# EAGLE design abletondevicecontroller (EAGLE 8.3.2)
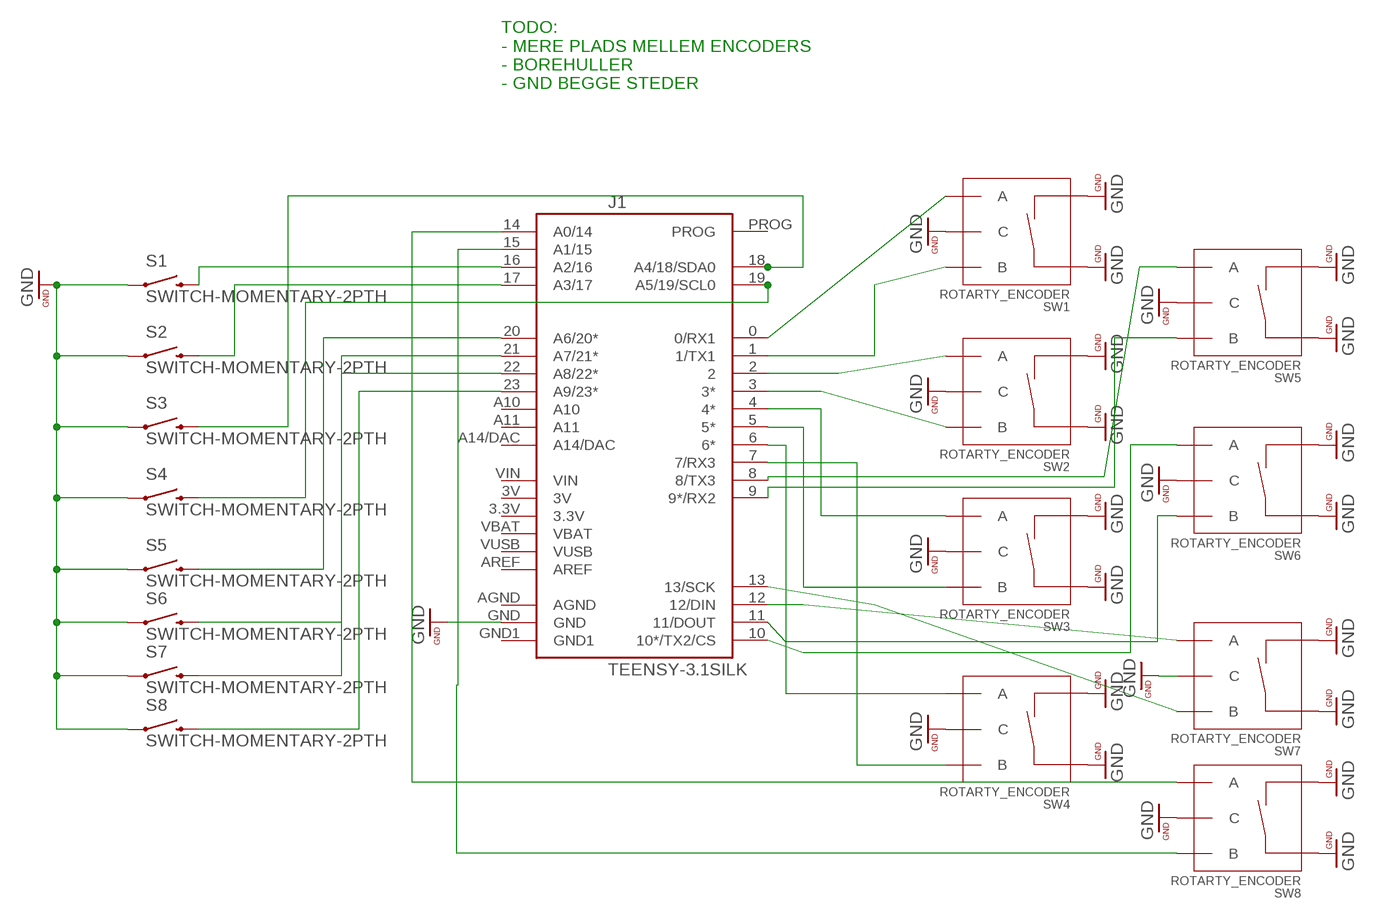
[diagram p0: schematic, sheet 1]

## Parts
J1  TEENSY-3.1SILK  [TEENSY-3.1]
S1  SWITCH-MOMENTARY-2PTH  [TACTILE-PTH]
S2  SWITCH-MOMENTARY-2PTH  [TACTILE-PTH]
S3  SWITCH-MOMENTARY-2PTH  [TACTILE-PTH]
S4  SWITCH-MOMENTARY-2PTH  [TACTILE-PTH]
S5  SWITCH-MOMENTARY-2PTH  [TACTILE-PTH]
S6  SWITCH-MOMENTARY-2PTH  [TACTILE-PTH]
S7  SWITCH-MOMENTARY-2PTH  [TACTILE-PTH]
S8  SWITCH-MOMENTARY-2PTH  [TACTILE-PTH]
SW1  ROTARTY_ENCODER  [ROTARY_ENC_PLAIN]
SW2  ROTARTY_ENCODER  [ROTARY_ENC_PLAIN]
SW3  ROTARTY_ENCODER  [ROTARY_ENC_PLAIN]
SW4  ROTARTY_ENCODER  [ROTARY_ENC_PLAIN]
SW5  ROTARTY_ENCODER  [ROTARY_ENC_PLAIN]
SW6  ROTARTY_ENCODER  [ROTARY_ENC_PLAIN]
SW7  ROTARTY_ENCODER  [ROTARY_ENC_PLAIN]
SW8  ROTARTY_ENCODER  [ROTARY_ENC_PLAIN]

## Nets
GND: J1.GND S1.1 S2.1 S3.1 S4.1 S5.1 S6.1 S7.1 S8.1 SW1.C SW1.SW+ SW1.SW- SW2.C SW2.SW+ SW2.SW- SW3.C SW3.SW+ SW3.SW- SW4.C SW4.SW+ SW4.SW- SW5.C SW5.SW+ SW5.SW- SW6.C SW6.SW+ SW6.SW- SW7.C SW7.SW+ SW7.SW- SW8.C SW8.SW+ SW8.SW-
N$1: J1.8(8/TX3) SW5.A
N$2: J1.9(9*/RX2) SW5.B
N$3: J1.10(10*/TX2/CS) SW6.A
N$4: J1.0(0/RX1) SW1.A
N$5: J1.1(1/TX1) SW1.B
N$6: J1.2 SW2.A
N$7: J1.3(3*) SW2.B
N$8: J1.4(4*) SW3.A
N$9: J1.5(5*) SW3.B
N$10: J1.6(6*) SW4.A
N$11: J1.7(7/RX3) SW4.B
N$12: J1.11(11/DOUT) SW6.B
N$13: J1.12(12/DIN) SW7.A
N$14: J1.13(13/SCK) SW7.B
N$15: J1.14(A0/14) SW8.A
N$16: J1.15(A1/15) SW8.B
N$17: J1.16(A2/16) S1.3
N$18: J1.17(A3/17) S2.3
N$19: J1.20(A6/20*) S5.3
N$20: J1.19(A5/19/SCL0) S4.3
N$21: J1.21(A7/21*) S6.3
N$22: J1.22(A8/22*) S7.3
N$23: J1.23(A9/23*) S8.3
N$28: J1.18(A4/18/SDA0) S3.3
Unconnected: J1.3.3V J1.3V J1.A10 J1.A11 J1.A14/DAC J1.AGND J1.AREF J1.GND1 J1.PROG J1.VBAT J1.VIN J1.VUSB

## Notes on the sheet
- TODO: 
  - MERE PLADS MELLEM ENCODERS
  - BOREHULLER
  - GND BEGGE STEDER

## Library data of the parts
J1 = SparkFun-Boards:TEENSY-3.1; SF_ID: DEV-12646
S1-S8 = SparkFun-Electromechanical:SWITCH-MOMENTARY-2: Various NO switches- pushbuttons, reed, etc; PROD_ID: SWCH-08441
SW1-SW8 = SparkFun-Electromechanical:ROTARTY_ENCODER: Simple no LED rotary encoder Example: COM-09117

## Board
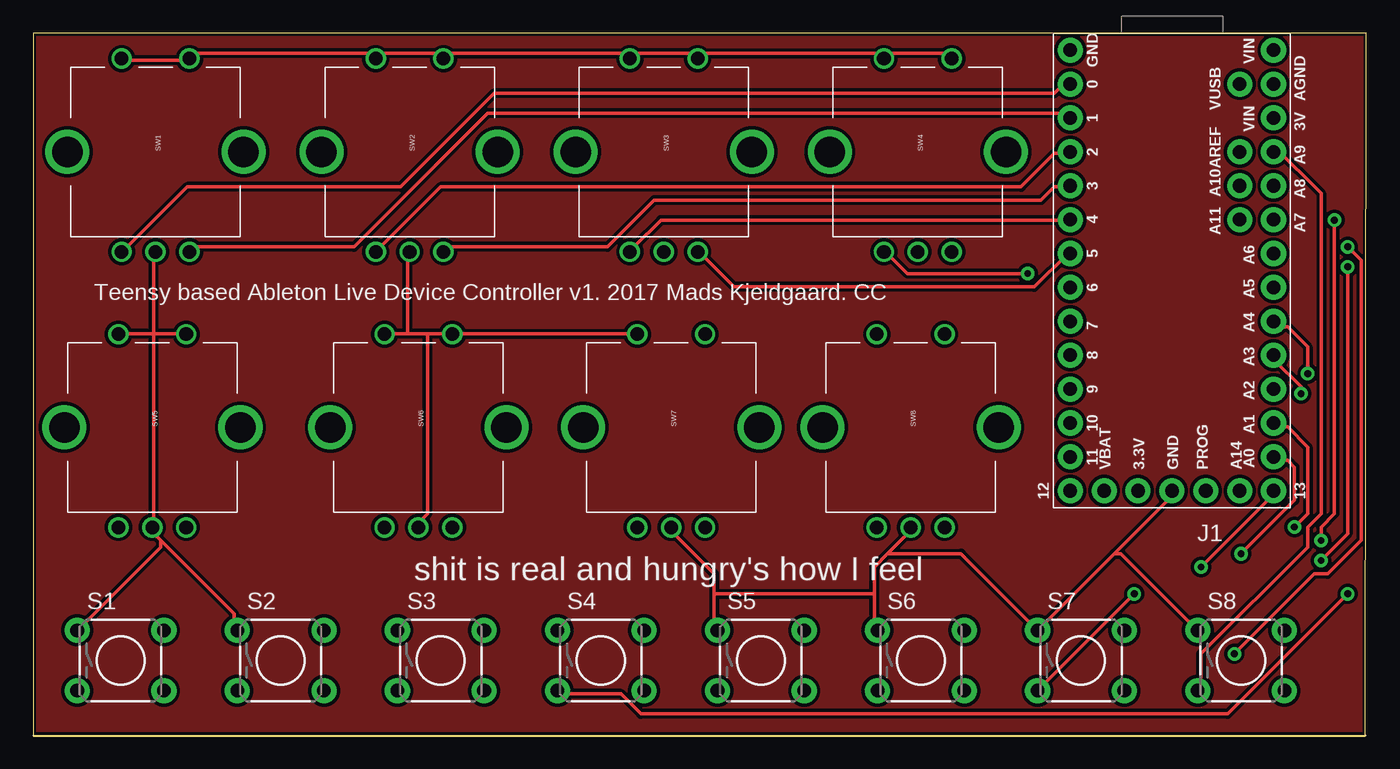
[diagram p1: board, top side]
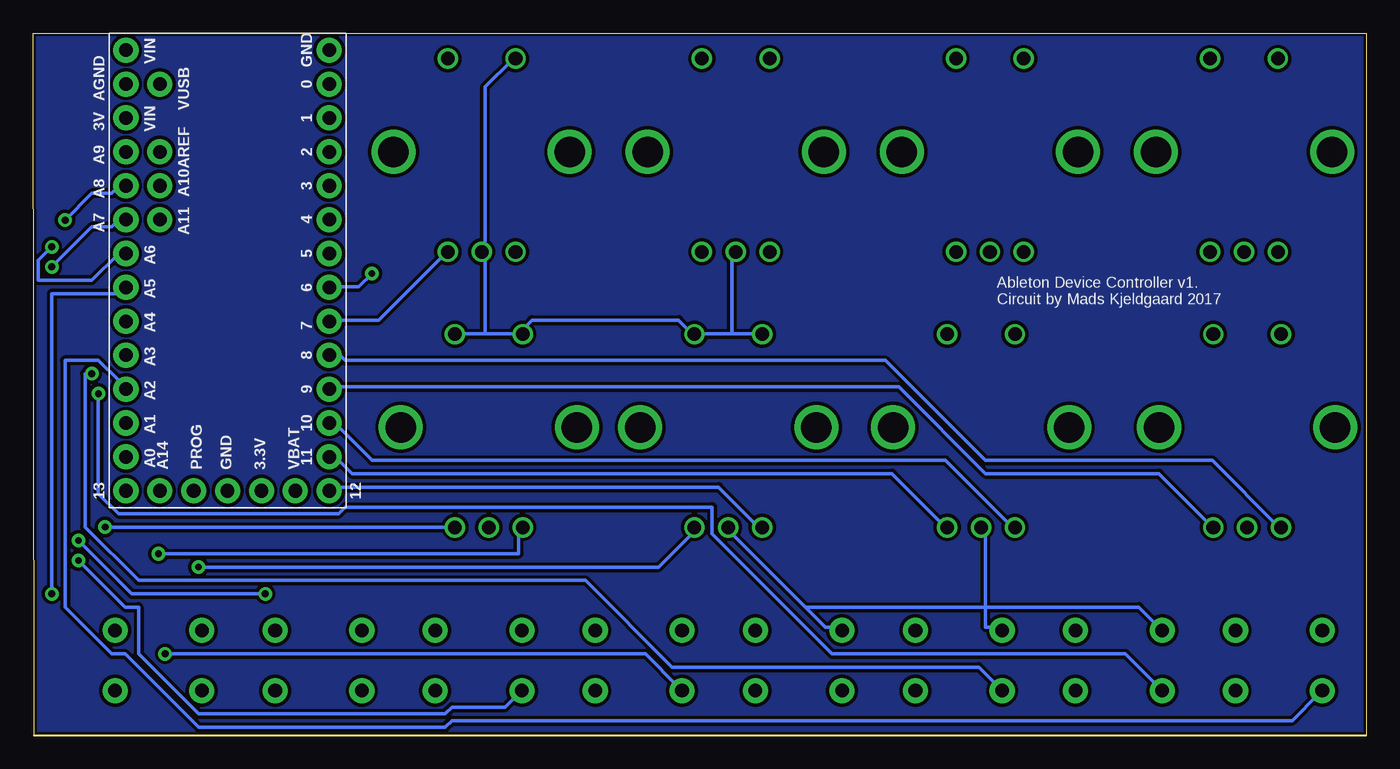
[diagram p2: board, bottom side, seen from below]

Size 99.92 x 52.63 mm. Coordinates in mm from the lower left corner, seen from the top.
Outline: 99.87,0 99.92,52.63 0,52.63 0,0 99.87,0
Copper layers (1*16): Top 0.035mm / dielectric 1.5mm / Bottom 0.035mm
Design rules "SparkFun-2-layer-STANDARD": minimum track width 10mil, minimum drill 20mil, track to track 10mil, track to pad 8mil, pad to pad 8mil, via to via 10mil, smd to smd 8mil, copper to edge 8mil, drill to drill 8mil, minimum pad ring 10mil, minimum via ring 10mil, stop-mask expansion 4mil, vias tented up to drill 25mil, thermal gap 10mil

### Footprints (pad centres in the part's own frame; a part is rotated, then mirrored left to right if it is on the bottom)
TEENSY-3.1 = drill 1.016 pad 1.88: 0 16.51,3.81; 1 16.51,6.35; 2 16.51,8.89; 3 16.51,11.43; 3.3V 11.43,34.29; 3V 1.27,6.35; 4 16.51,13.97; 5 16.51,16.51; 6 16.51,19.05; 7 16.51,21.59; 8 16.51,24.13; 9 16.51,26.67; 10 16.51,29.21; 11 16.51,31.75; 12 16.51,34.29; 13 1.27,34.29; 14 1.27,31.75; 15 1.27,29.21; 16 1.27,26.67; 17 1.27,24.13; 18 1.27,21.59; 19 1.27,19.05; 20 1.27,16.51; 21 1.27,13.97; 22 1.27,11.43; 23 1.27,8.89; A10 3.81,11.43; A11 3.81,13.97; A14/DAC 3.81,34.29; AGND 1.27,3.81; AREF 3.81,8.89; GND 8.89,34.29; GND1 16.51,1.27; PROG 6.35,34.29; VBAT 13.97,34.29; VIN 1.27,1.27; VUSB 3.81,3.81
TACTILE-PTH = drill 1.016 pad 1.88: 1 -3.251,2.261; 2 3.251,2.261; 3 -3.251,-2.261; 4 3.251,-2.261
ROTARY_ENC_PLAIN = drill 1.016: A 7.493,-2.54; B 7.493,2.54; C 7.493,0; SW+ -6.985,2.54; SW- -6.985,-2.54 | drill 2.286: P$3 0,6.604; P$4 0,-6.604

### Placement (x,y rotation side)
J1  94.25,52.64 180 top
S1  6.54,5.63 0 top
S2  18.54,5.63 0 top
S3  30.54,5.63 0 top
S4  42.54,5.63 0 top
S5  54.54,5.63 0 top
S6  66.54,5.63 0 top
S7  78.54,5.63 0 top
S8  90.54,5.63 0 top
SW1  9.16,43.75 270 top
SW2  28.21,43.75 270 top
SW3  47.26,43.75 270 top
SW4  66.31,43.75 270 top
SW5  8.92,23.1 270 top
SW6  28.87,23.1 270 top
SW7  47.82,23.1 270 top
SW8  65.77,23.1 270 top

### Tracks (layer width: path | path; a pad name or v marks a point on that pad's centre or on a via)
GND
  Top 0.254: SW4.SW+ 68.54,51.13 64.04,51.13 SW4.SW- 63.54,51.13 50.04,51.13 SW3.SW+ 49.54,51.13 45.04,51.13 SW3.SW- 44.54,51.13 31.04,51.13 SW2.SW+ 30.54,51.13 26.04,51.13 SW2.SW- 25.54,51.13 12.04,51.13 SW1.SW+ 11.54,50.63 7.04,50.63 SW1.SW- | 9.04,30.13 11.04,30.13 SW5.SW+ | 9.04,30.13 6.54,30.13 SW5.SW- | 9.04,30.13 9.04,36.13 SW1.C | 9.54,14.63 15.04,9.13 15.04,8.13 S2.1 | 9.54,14.63 9.04,15.13 SW5.C 9.04,15.63 9.04,30.13 | 9.54,14.63 9.54,14.13 3.54,8.13 S1.1 | 81.04,13.63 85.54,18.13 J1.GND | 81.04,13.63 75.54,8.13 S7.1 75.04,8.13 69.54,13.63 64.04,13.63 | 81.04,13.63 81.54,13.63 87.04,8.13 S8.1 | 64.04,13.63 63.04,12.63 63.04,10.63 | 64.04,13.63 65.54,15.13 SW8.C | 63.04,10.63 63.04,8.13 S6.1 | 29.54,30.13 31.04,30.13 SW6.SW+ 31.54,30.13 45.04,30.13 SW7.SW- | 29.54,30.13 28.04,30.13 | 28.04,30.13 26.54,30.13 SW6.SW- | 28.04,30.13 28.04,36.13 SW2.C | 51.04,10.63 51.04,12.13 48.04,15.13 SW7.C | 51.04,10.63 51.04,8.13 S5.1 | 29.54,30.13 29.54,16.63 28.54,15.63 SW6.C | 51.04,10.63 63.04,10.63
  Bottom 0.254: 47.54,30.13 50.04,30.13 SW7.SW+ 50.54,30.13 51.54,31.13 62.54,31.13 63.54,30.13 | 47.54,30.13 45.54,30.13 SW7.SW- | 47.54,30.13 47.54,36.13 SW3.C | 66.04,30.13 68.04,30.13 SW8.SW+ | 66.04,30.13 63.54,30.13 | 66.04,30.13 66.04,36.13 SW4.C 66.04,36.63 66.04,48.63 64.04,50.63 SW4.SW- | 63.54,30.13 SW8.SW- | 28.54,9.63 28.54,8.13 27.54,8.13 S3.1 | 28.54,9.63 28.54,15.13 SW6.C | 42.04,9.63 40.54,8.13 39.54,8.13 S4.1 | 42.04,9.63 47.54,15.13 SW7.C | 42.04,9.63 28.54,9.63 | 28.54,9.63 17.04,9.63 15.54,8.13 S2.1
N$1
  Bottom 0.254: SW5.A 6.54,15.63 11.54,20.63 28.54,20.63 36.04,28.13 76.54,28.13 77.04,28.63 77.54,28.63 J1.8
N$2
  Bottom 0.254: SW5.B 11.54,15.63 15.54,19.63 28.54,19.63 35.04,26.13 77.54,26.13 J1.9
N$3
  Bottom 0.254: SW6.A 26.54,15.63 31.54,20.63 74.54,20.63 77.04,23.13 77.54,23.13 J1.10
N$4
  Top 0.254: SW1.A 7.04,36.63 11.54,41.13 27.54,41.13 34.54,48.13 76.54,48.13 77.54,49.13 J1.0
N$5
  Top 0.254: SW1.B 12.04,36.63 24.04,36.63 34.04,46.63 77.54,46.63 J1.1
N$6
  Top 0.254: SW2.A 26.04,36.63 30.54,41.13 74.04,41.13 76.54,43.63 77.54,43.63 J1.2
N$7
  Top 0.254: SW2.B 31.04,36.63 43.04,36.63 46.54,40.13 75.54,40.13 76.54,41.13 77.54,41.13 J1.3
N$8
  Top 0.254: SW3.A 45.04,36.63 47.04,38.63 77.54,38.63 J1.4
N$9
  Top 0.254: SW3.B 50.04,36.13 52.54,33.63 75.04,33.63 77.54,36.13 J1.5
N$10  (via drill 0.51)
  Top 0.254: v74.54,34.63 65.54,34.63 64.04,36.13 SW4.A
  Bottom 0.254: v74.54,34.63 75.54,33.63 77.54,33.63 J1.6
N$11
  Bottom 0.254: SW4.B 69.04,36.13 74.04,31.13 77.54,31.13 J1.7
N$12
  Bottom 0.254: SW6.B 31.54,15.63 35.54,19.63 76.04,19.63 77.04,20.63 77.54,20.63 J1.11
N$13
  Bottom 0.254: SW7.A 45.54,15.63 48.54,18.63 77.54,18.63 J1.12
N$14  (via drill 0.51)
  Top 0.254: v87.54,12.63 93.04,18.13 J1.13
  Bottom 0.254: v87.54,12.63 53.04,12.63 50.54,15.13 SW7.B
N$15  (via drill 0.51)
  Top 0.254: v90.54,13.63 94.54,17.63 94.54,20.13 94.04,20.63 93.04,20.63 J1.14
  Bottom 0.254: v90.54,13.63 63.54,13.63 63.54,15.13 SW8.A
N$16  (via drill 0.51)
  Top 0.254: v94.54,15.63 95.54,16.63 95.54,21.63 94.04,23.13 93.04,23.13 J1.15
  Bottom 0.254: v94.54,15.63 68.54,15.63 SW8.B
N$17
  Bottom 0.254: S1.3 3.54,3.13 5.54,1.13 68.54,1.13 69.04,0.63 87.54,0.63 93.04,6.13 94.04,6.13 97.54,9.63 97.54,28.13 95.04,28.13 93.54,26.63 93.54,26.13 93.04,26.13 J1.16
N$18  (via drill 0.51)
  Top 0.254: v95.04,25.63 95.04,26.13 93.04,28.13 J1.17
  Bottom 0.254: v95.04,25.63 95.04,18.13 93.54,16.63 77.04,16.63 76.54,17.13 49.04,17.13 49.04,15.13 40.04,6.13 18.04,6.13 15.54,3.63 S2.3
N$19  (via drill 0.51)
  Top 0.254: v90.04,6.13 96.04,12.13 97.04,12.13 99.54,14.63 99.54,35.63 v98.54,36.63
  Bottom 0.254: v90.04,6.13 54.04,6.13 51.54,3.63 S5.3 | v98.54,36.63 99.54,35.63 99.54,34.13 95.54,34.13 93.54,36.13 J1.20
N$20  (via drill 0.51)
  Top 0.254: v98.54,10.63 89.54,1.63 45.54,1.63 44.04,3.13 39.54,3.13 S4.3
  Bottom 0.254: v98.54,10.63 98.54,33.13 93.04,33.13 J1.19
N$21  (via drill 0.51)
  Top 0.254: v96.54,13.13 98.54,15.13 v98.54,35.13
  Bottom 0.254: v96.54,13.13 93.04,9.63 92.04,9.63 92.04,6.13 87.54,1.63 69.04,1.63 68.54,2.13 64.54,2.13 63.54,3.13 S6.3 | v98.54,35.13 95.54,38.13 94.04,38.13 93.54,38.63 93.04,38.63 J1.21
N$22  (via drill 0.51)
  Top 0.254: v82.54,10.63 75.54,3.63 S7.3 | v96.54,14.63 96.54,15.63 97.54,16.63 v97.54,38.63
  Bottom 0.254: v82.54,10.63 92.54,10.63 v96.54,14.63 | v97.54,38.63 95.54,40.63 94.04,40.63 93.54,41.13 93.04,41.13 J1.22
N$23
  Top 0.254: S8.3 87.54,3.63 87.54,6.13 95.54,14.13 95.54,15.63 96.54,16.63 96.54,40.63 93.04,44.13 J1.23
N$25
  pour Top: 0,52.64 0,0 99.87,0 99.87,52.64
N$26
  pour Bottom: 0,52.64 0,0 99.87,0 99.87,52.64
N$28  (via drill 0.51)
  Top 0.254: v95.54,27.13 95.54,29.13 94.04,30.63 93.04,30.63 J1.18
  Bottom 0.254: v95.54,27.13 96.04,27.13 96.04,15.63 92.04,11.63 58.54,11.63 52.04,5.13 29.04,5.13 27.54,3.63 S3.3

### Text on the board
Top: TODO: / - BETTER SPACING BETWEEN ENCODERS / - MOUNTING HOLES (for backplate) / - BACKPLATE / -SMD HEADERS FOR TEENSY / - LARGER HOLES FOR ENCODER CHEEKS
bPlace: Ableton Device Controller v1. / Circuit by Mads Kjeldgaard 2017
tNames: Teensy based Ableton Live Device Controller v1. 2017 Mads Kjeldgaard. CC | shit is real and hungry's how I feel